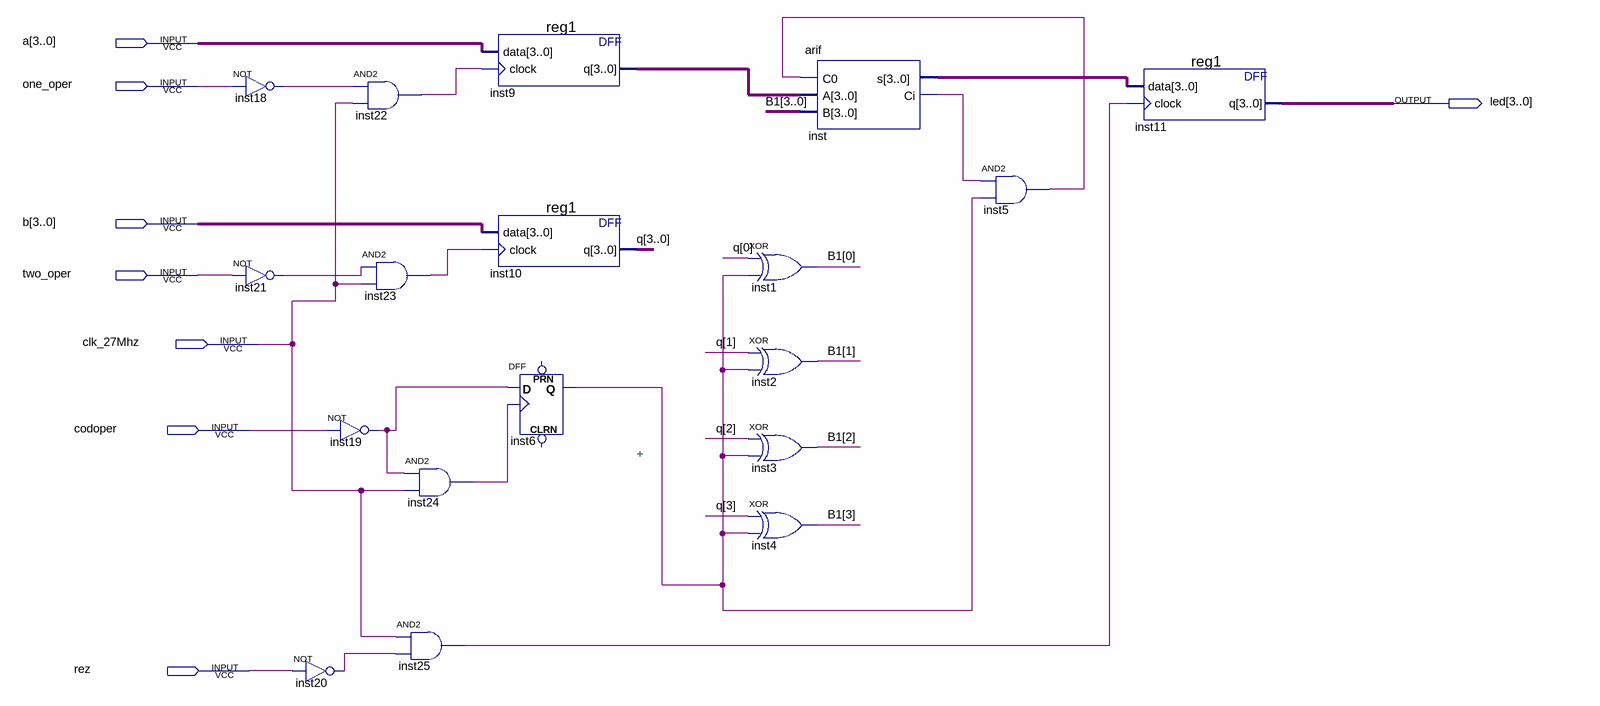
[diagram p0: schematic sheet]
// Quartus schematic arifmet.bdf as structural Verilog: 18 symbols, 8 pins
module arifmet (
  input  [3:0] a,
  input  one_oper,
  input  [3:0] b,
  input  two_oper,
  input  clk_27Mhz,
  input  codoper,
  input  rez,
  output [3:0] led
);

  wire inst5_out, inst6_q, inst18_out, inst19_out, inst20_out, inst21_out, inst22_out, inst23_out,
       inst24_out, inst25_out, inst_ci;
  wire [3:0] B1, inst9_q, inst_s, q;

  not inst18 (inst18_out, one_oper);
  not inst21 (inst21_out, two_oper);
  not inst20 (inst20_out, rez);
  and inst22 (inst22_out, inst18_out, clk_27Mhz);
  and inst23 (inst23_out, inst21_out, clk_27Mhz);
  not inst19 (inst19_out, codoper);
  and inst24 (inst24_out, inst19_out, clk_27Mhz);
  and inst25 (inst25_out, clk_27Mhz, inst20_out);
  reg1 inst9 (.data(a), .clock(inst22_out), .q(inst9_q));
  reg1 inst10 (.data(b), .clock(inst23_out), .q(q));
  DFF inst6 (.CLK(inst24_out), .D(inst19_out), .Q(inst6_q));  // open: CLRN, PRN
  xor inst1 (B1[0], q[0], inst6_q);
  xor inst2 (B1[1], q[1], inst6_q);
  xor inst3 (B1[2], q[2], inst6_q);
  xor inst4 (B1[3], q[3], inst6_q);
  arif inst (.C0(inst5_out), .A(inst9_q), .B(B1), .s(inst_s), .Ci(inst_ci));
  and inst5 (inst5_out, inst_ci, inst6_q);
  reg1 inst11 (.data(inst_s), .clock(inst25_out), .q(led));

  // Notes on the sheet:
  //   +
endmodule
